# Altium schematic sheet button.SchDoc
size A4
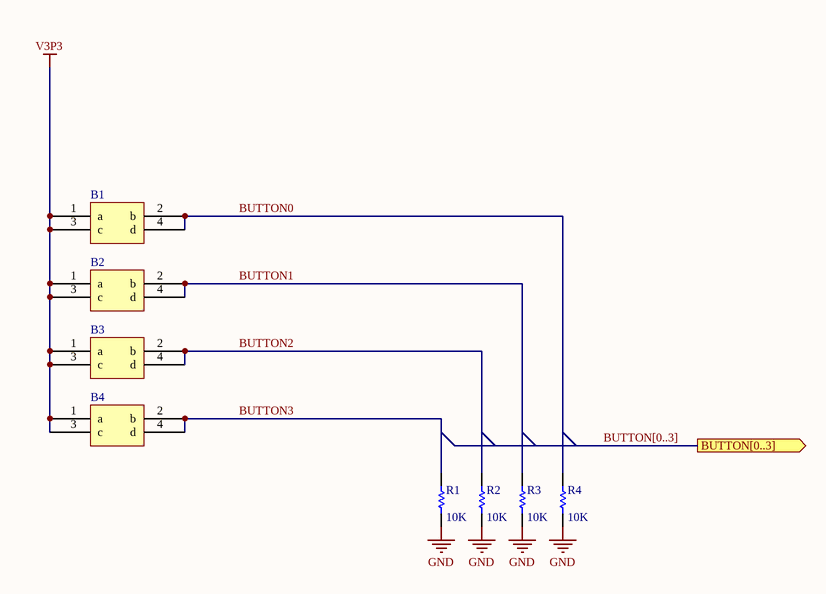
[diagram p0: button.SchDoc]

## Parts
B1  ESE20C  [BUTTON_DIS]  (value not drawn)
B2  ESE20C  [BUTTON_DIS]  (value not drawn)
B3  ESE20C  [BUTTON_DIS]  (value not drawn)
B4  ESE20C  [BUTTON_DIS]  (value not drawn)
R1  value 10K  [RESISTANCE]  (hidden comment: Res1)
R2  value 10K  [RESISTANCE]  (hidden comment: Res1)
R3  value 10K  [RESISTANCE]  (hidden comment: Res1)
R4  value 10K  [RESISTANCE]  (hidden comment: Res1)

## Ports
BUTTON[0..3] (out)

## Nets
GND: R1.1 R2.1 R3.1 R4.1
V3P3: B1.1(a) B1.3(c) B2.1(a) B2.3(c) B3.1(a) B3.3(c) B4.1(a) B4.3(c)
BUTTON0: B1.2(b) B1.4(d) R4.2
BUTTON1: B2.2(b) B2.4(d) R3.2
BUTTON2: B3.2(b) B3.4(d) R2.2
BUTTON3: B4.2(b) B4.4(d) R1.2

## Buses and harness runs
bus BUTTON[0..3] = port BUTTON[0..3]

## Library data of the parts
B1-B4 = BUTTON_DIS: Push switch; Fournisseur: Farnell; Fabricant: Panasonic; Ref. fabricant: ESE20C441; Ref. fournisseur: 2079607
R1-R4 = Res1: Resistor; Published: 8-Jun-2000; LatestRevisionDate: 17-Jul-2002; LatestRevisionNote: Re-released for DXP Platform.; PackageReference: AXIAL-0.3; Publisher: Altium Limited; PackageDescription: Axial Device, Thru-Hole; 2 Leads; 0.3 in Pin Spacing